# Altium project STM32F0.PrjPCB
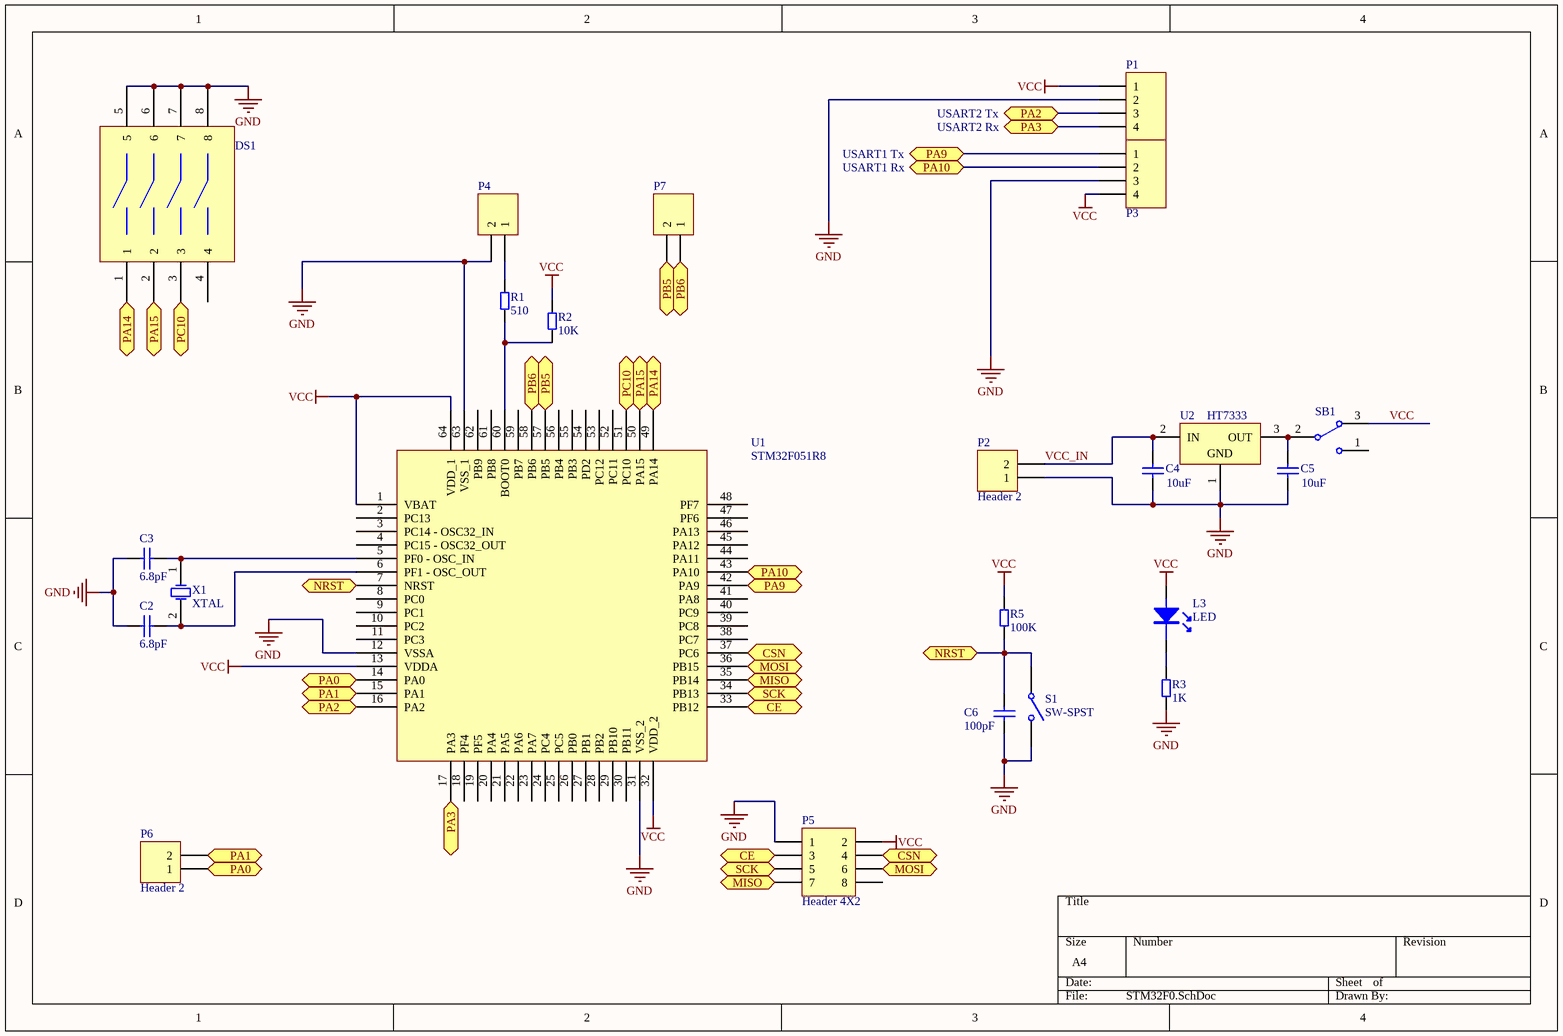
[diagram p0: STM32F0.SchDoc]
1 sheet, 23 parts. Net scope: flat (ports and power ports of the same name join across sheets).
Board files: STM32F0 Bigger.PcbDoc, STM32F0 Bigger version 3.PcbDoc

## Sheet STM32F0.SchDoc: STM32F0 Minimum System
size A4

### Parts
C2  value 6.8pF  [CAP-0603]  (hidden comment: Cap)
C3  value 6.8pF  [CAP-0603]  (hidden comment: Cap)
C4  value 10uF  [CAP-0603]  (hidden comment: Cap)
C5  value 10uF  [CAP-0603]  (hidden comment: Cap)
C6  value 100pF  [CAP-0603]  (hidden comment: Cap)
DS1  Dial Switch  (value not drawn)
L3  LED  [RES-0603]
P1  Header 4  [HDR1X4]  (value not drawn)
P2  Header 2  [HDR1X2]
P3  Header 4  [HDR1X4]  (value not drawn)
P4  Header 2  [HDR1X2]  (value not drawn)
P5  Header 4X2  [HDR2X4]
P6  Header 2  [HDR1X2]
P7  Header 2  [HDR1X2]  (value not drawn)
R1  510  [RES-0603]
R2  10K  [RES-0603]
R3  1K  [RES-0603]
R5  100K  [RES-0603]
S1  SW-SPST  [CP-SW]
SB1  SW-SPDT  [HDR1X3]  (value not drawn)
U1  STM32F051R8  [LQFP64_L]
U2  HT7333  [SOT89N]
X1  XTAL  [晶振-1]

### Ports
CE, CSN, MISO, MOSI, NRST, PA0, PA1, PA2, PA3, PA9, PA10, PA14, PA15, PB5, PB6, PC10, SCK

### Nets
GND: C2.1 C3.1 C4.1 C5.1 C6.1 DS1.5 DS1.6 DS1.7 DS1.8 P1.2 P2.1 P3.3 P4.2 P5.1 R3.2 S1.2(NO) U1.12(VSSA) U1.31(VSS_2) U1.63(VSS_1) U2.1(GND)
VCC: L3.1 P1.1 P3.4 P5.2 R2.2 R5.2 SB1.3 U1.1(VBAT) U1.13(VDDA) U1.32(VDD_2) U1.64(VDD_1)
VCC_IN: C4.2 P2.2 U2.2(IN)
NetC2_2: C2.2 U1.6(PF1_-_OSC_OUT) X1.2(OSC2)
NetC3_2: C3.2 U1.5(PF0_-_OSC_IN) X1.1(OSC1)
NetC5_2: C5.2 SB1.2 U2.3(OUT)
NetC6_2: C6.2 R5.1 S1.1(COMMON) U1.7(NRST) ; port NRST
NetDS1_1: DS1.1 U1.49(PA14) ; port PA14
NetDS1_2: DS1.2 U1.50(PA15) ; port PA15
NetDS1_3: DS1.3 U1.51(PC10) ; port PC10
NetL3_2: L3.2 R3.1
NetP1_3: P1.3 U1.16(PA2) ; port PA2
NetP1_4: P1.4 U1.17(PA3) ; port PA3
NetP3_1: P3.1 U1.42(PA9) ; port PA9
NetP3_2: P3.2 U1.43(PA10) ; port PA10
NetP4_1: P4.1 R1.2
NetP5_3: P5.3 U1.33(PB12) ; port CE
NetP5_4: P5.4 U1.37(PC6) ; port CSN
NetP5_5: P5.5 U1.34(PB13) ; port SCK
NetP5_6: P5.6 U1.36(PB15) ; port MOSI
NetP5_7: P5.7 U1.35(PB14) ; port MISO
NetP6_1: P6.1 U1.14(PA0) ; port PA0
NetP6_2: P6.2 U1.15(PA1) ; port PA1
NetP7_1: P7.1 U1.58(PB6) ; port PB6
NetP7_2: P7.2 U1.57(PB5) ; port PB5
NetR1_1: R1.1 R2.1 U1.60(BOOT0)

Not connected (* = marked no-connect by the designer): DS1 4; P5 8; SB1 1; U1 2(PC13) 3(PC14_-_OSC32_IN) 4(PC15_-_OSC32_OUT) 8(PC0) 9(PC1) 10(PC2) 11(PC3) 18(PF4) 19(PF5) 20(PA4) 21(PA5) 22(PA6) 23(PA7) 24(PC4) 25(PC5) 26(PB0) 27(PB1) 28(PB2) 29(PB10) 30(PB11) 38(PC7) 39(PC8) 40(PC9) 41(PA8) 44(PA11) 45(PA12) 46(PA13) 47(PF6) 48(PF7) 52(PC11) 53(PC12) 54(PD2) 55(PB3) 56(PB4) 59(PB7) 61(PB8) 62(PB9)

### Notes on the sheet
- USART2 Tx
- USART1 Tx
- USART1 Rx
- USART2 Rx

### Library data of the parts
C2-C6 = Cap: Capacitor; Published: 8-Jun-2000; LatestRevisionDate: 17-Jul-2002; LatestRevisionNote: Re-released for DXP Platform.; PackageReference: RAD-0.3; Publisher: Altium Limited
DS1 = DS-4
L3 = LED: LED发光管
P1 P3 = Header 4: Header, 4-Pin; LatestRevisionDate: 17-Jul-2002; LatestRevisionNote: Re-released for DXP Platform.; Publisher: Altium Limited
P2 P4 P6 P7 = Header 2: Header, 2-Pin; LatestRevisionDate: 17-Jul-2002; LatestRevisionNote: Re-released for DXP Platform.; Publisher: Altium Limited
P5 = Header 4X2: Header, 4-Pin, Dual row; LatestRevisionDate: 17-Jul-2002; LatestRevisionNote: Re-released for DXP Platform.; Publisher: Altium Limited
R1-R3 R5 = R: 电阻
S1 = SW-SPST: Single-Pole, Single-Throw Switch; Published: 24-Mar-1999; LatestRevisionDate: 17-Jul-2002; LatestRevisionNote: Re-released for DXP Platform.; PackageReference: SPST-2; Publisher: Altium Limited
SB1 = SW-SPDT: SPDT Subminiature Toggle Switch, Right Angle Mounting, Vertical Actuation; Published: 24-Mar-1999; LatestRevisionDate: 17-Dec-2003; LatestRevisionNote: Schematic revised, PCB Footprint replaced.; DatasheetVersion: 05-Dec-2000; PackageReference: TL36WW15050; Publisher: Altium Limited; ComponentLink1Description: Manufacturer Link; ComponentLink1URL: http://www.apem.com
U1 = STM32F051R8T6
U2 = HT7530-1: 3.0V 100mA Low Power,  Low Dropout Voltage (LDO) Regulator; Published: 30-Mar-2007; DatasheetVersion: rev1.50, Jan-2006; PackageVersion: Jan-2006; PackageReference: SOT-89; Publisher: Altium Limited; PackageDescription: 3-Pin SOT-89 Package 1.5 mm Pitch, 4.1 mm Lead Span; Code_IPC: SOT89; ComponentLink1Description: Manufacturer Link; ComponentLink1URL: http://www.holtek.com/; ComponentLink2Description: Datasheet; ComponentLink2URL: http://www.holtek.com/pdf/consumer/75xx_1v150.pdf
X1 = XTAL: Crystal Oscillator; Published: 8-Jun-2000; LatestRevisionDate: 17-Jul-2002; LatestRevisionNote: Re-released for DXP Platform.; PackageReference: R38; Publisher: Altium Limited